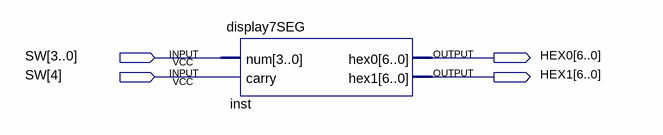
[diagram p0: schematic sheet]
// Quartus schematic part4_sch.bdf as structural Verilog: 1 symbols, 4 pins
module part4_sch (
  input  [4:0] SW,
  output [6:0] HEX0,
  output [6:0] HEX1
);

  display7SEG inst (.num(SW[3:0]), .carry(SW[4]), .hex0(HEX0), .hex1(HEX1));
endmodule
